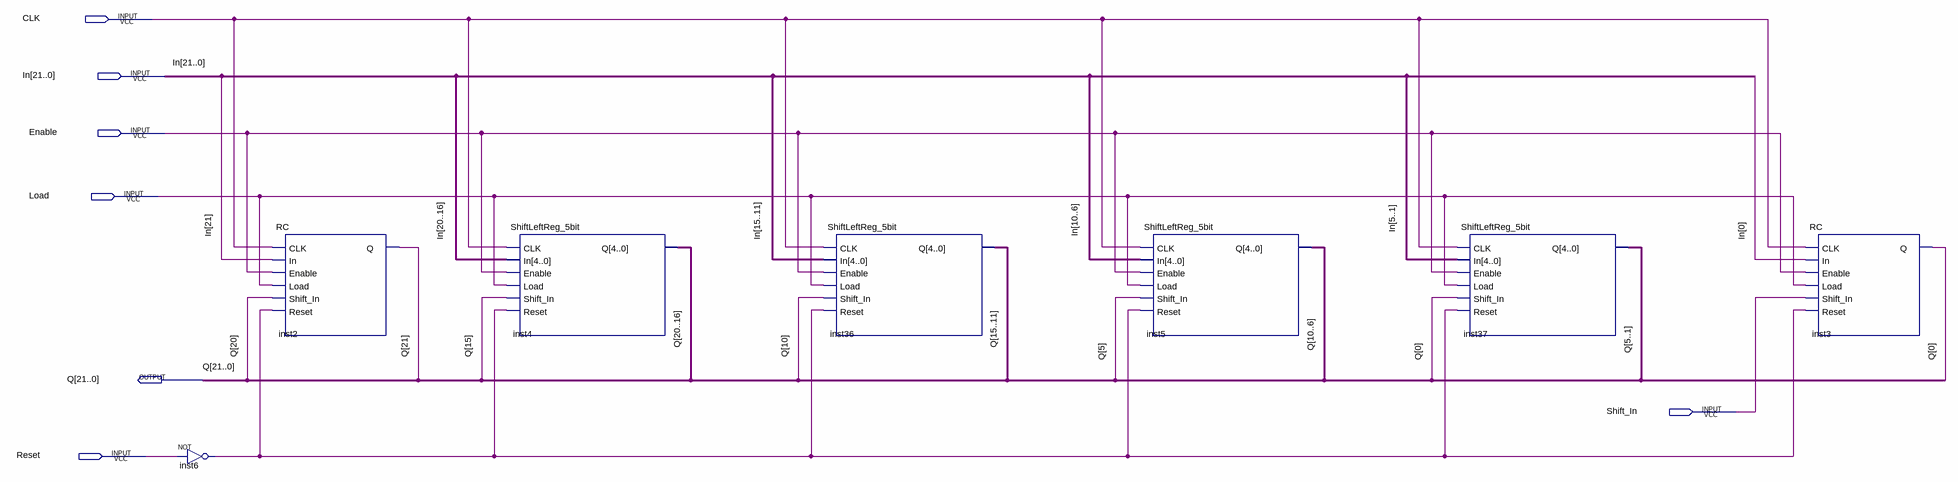
[diagram p0: schematic sheet]
// Quartus schematic ShiftLeftReg_22bit_Shiftin.bdf as structural Verilog: 7 symbols, 7 pins
module ShiftLeftReg_22bit_Shiftin (
  input  CLK,
  input  [21:0] In,
  input  Enable,
  input  Load,
  input  Shift_In,
  input  Reset,
  output [21:0] Q
);

  wire inst6_out;

  not inst6 (inst6_out, Reset);
  RC inst2 (.CLK(CLK), .In(In[21]), .Enable(Enable), .Load(Load), .Shift_In(Q[20]), .Reset(inst6_out), .Q(Q[21]));
  ShiftLeftReg_5bit inst4 (
    .CLK(CLK), .In(In[20:16]), .Enable(Enable), .Load(Load), .Shift_In(Q[15]), .Reset(inst6_out), .Q(Q[20:16]));
  ShiftLeftReg_5bit inst36 (
    .CLK(CLK), .In(In[15:11]), .Enable(Enable), .Load(Load), .Shift_In(Q[10]), .Reset(inst6_out), .Q(Q[15:11]));
  ShiftLeftReg_5bit inst5 (
    .CLK(CLK), .In(In[10:6]), .Enable(Enable), .Load(Load), .Shift_In(Q[5]), .Reset(inst6_out), .Q(Q[10:6]));
  ShiftLeftReg_5bit inst37 (
    .CLK(CLK), .In(In[5:1]), .Enable(Enable), .Load(Load), .Shift_In(Q[0]), .Reset(inst6_out), .Q(Q[5:1]));
  RC inst3 (.CLK(CLK), .In(In[0]), .Enable(Enable), .Load(Load), .Shift_In(Shift_In), .Reset(inst6_out), .Q(Q[0]));
endmodule
